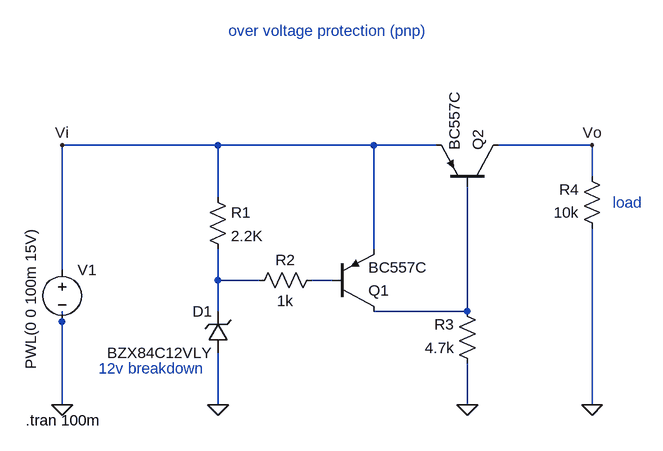
[diagram p0: schematic task 2.asc]
task 2.asc, the LTspice schematic file:
Version 4.1
SHEET 1 880 1064
WIRE 192 -80 -48 -80
WIRE 432 -80 192 -80
WIRE 528 -80 432 -80
WIRE 768 -80 624 -80
WIRE 768 -32 768 -80
WIRE 192 0 192 -80
WIRE 432 80 432 -80
WIRE -48 112 -48 -80
WIRE 192 128 192 80
WIRE 256 128 192 128
WIRE 368 128 336 128
WIRE 192 176 192 128
WIRE 576 176 576 -16
WIRE 576 176 432 176
WIRE -48 192 -48 176
WIRE -48 320 -48 192
WIRE 192 320 192 240
WIRE 576 320 576 256
WIRE 768 320 768 48
FLAG 576 320 0
FLAG 192 320 0
FLAG -48 320 0
FLAG 768 320 0
FLAG 768 -80 Vo
FLAG -48 -80 Vi
SYMBOL res 176 -16 R0
SYMATTR InstName R1
SYMATTR Value 2.2K
SYMBOL res 352 112 R90
WINDOW 0 0 56 VBottom 2
WINDOW 3 32 56 VTop 2
SYMATTR InstName R2
SYMATTR Value 1k
SYMBOL res 592 272 R180
WINDOW 0 36 76 Left 2
WINDOW 3 36 40 Left 2
SYMATTR InstName R3
SYMATTR Value 4.7k
SYMBOL res 784 64 R180
WINDOW 0 36 76 Left 2
WINDOW 3 36 40 Left 2
SYMATTR InstName R4
SYMATTR Value 10k
SYMBOL voltage -48 96 R0
WINDOW 3 -48 -49 VRight 2
WINDOW 123 0 0 Left 0
WINDOW 39 0 0 Left 0
SYMATTR Value PWL(0 0 100m 15V)
SYMATTR InstName V1
SYMBOL zener 208 240 R180
WINDOW 0 24 64 Left 2
WINDOW 3 24 0 Left 2
SYMATTR InstName D1
SYMATTR Value BZX84C12VLY
SYMBOL pnp 368 176 M180
SYMATTR InstName Q1
SYMATTR Value BC557C
SYMBOL pnp 624 -16 M270
SYMATTR InstName Q2
SYMATTR Value BC557C
TEXT 800 8 Left 2 ;load
TEXT -104 344 Left 2 !.tran 100m
TEXT 8 264 Left 2 ;12v breakdown
TEXT 208 -256 Left 2 ;over voltage protection (pnp)

The netlist it stands for:
* task 2.asc
R1 Vi N001 2.2K
R2 N002 N001 1k
R3 0 N003 4.7k
R4 0 Vo 10k
V1 Vi 0 PWL(0 0 100m 15V)
D1 0 N001 BZX84C12VLY
Q1 N003 N002 Vi 0 BC557C
Q2 Vo N003 Vi 0 BC557C
.model D D
.lib standard.dio
.model NPN NPN
.model PNP PNP
.lib standard.bjt
* load
.tran 100m
* 12v breakdown
* over voltage protection (pnp)
.backanno
.end

* Results of the author's LTspice run, read from the files saved beside the schematic
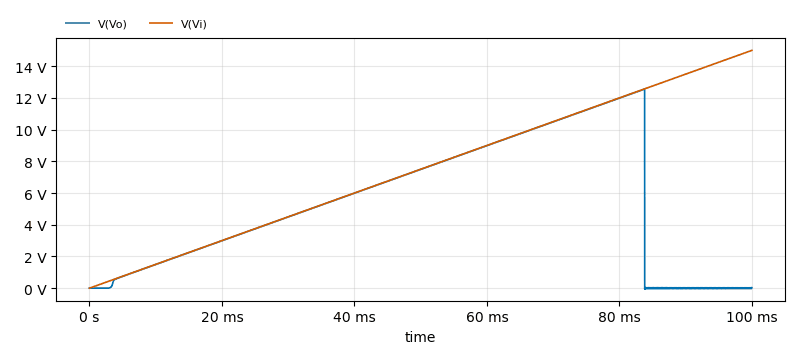
[diagram p1: Transient Analysis of task 2.asc, plotted from the saved traces]
* Transient Analysis, 1 run:
*   V(Vo): min -40.27 mV, max 12.55 V, average 5.253 V, rms 6.812 V, last 31.03 mV
*   V(Vi): min 0 V, max 15 V, average 7.5 V, rms 8.795 V, last 15 V